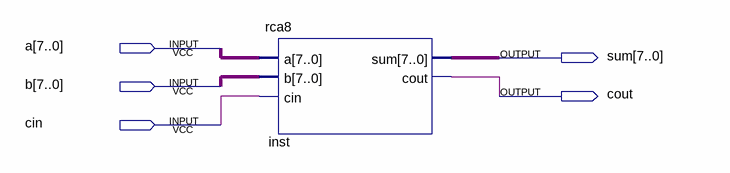
[diagram p0: schematic sheet]
// Quartus schematic 8b_rca.bdf as structural Verilog: 1 symbols, 5 pins
module \8b_rca  (
  input  [7:0] a,
  input  [7:0] b,
  input  cin,
  output [7:0] sum,
  output cout
);

  rca8 inst (.a(a), .b(b), .cin(cin), .sum(sum), .cout(cout));
endmodule
